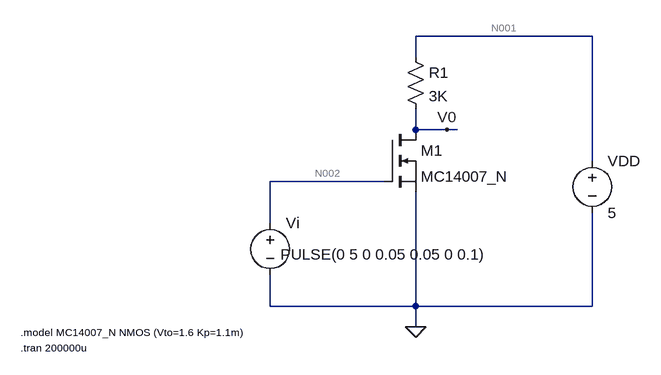
[diagram p0: schematic 1.2.3.asc]
1.2.3.asc, the LTspice schematic file:
Version 4
SHEET 1 880 680
WIRE 672 -128 400 -128
WIRE 400 -96 400 -128
WIRE 400 16 400 -16
WIRE 448 16 400 16
WIRE 464 16 448 16
WIRE 672 64 672 -128
WIRE 352 96 176 96
WIRE 176 160 176 96
WIRE 176 288 176 240
WIRE 400 288 400 112
WIRE 400 288 176 288
WIRE 672 288 672 144
WIRE 672 288 400 288
WIRE 400 320 400 288
FLAG 400 320 0
FLAG 448 16 V0
SYMBOL voltage 176 144 R0
WINDOW 3 16 64 Left 2
WINDOW 123 0 0 Left 0
WINDOW 39 0 0 Left 0
SYMATTR Value PULSE(0 5 0 0.05 0.05 0 0.1)
SYMATTR InstName Vi
SYMBOL voltage 672 48 R0
WINDOW 123 0 0 Left 0
WINDOW 39 0 0 Left 0
SYMATTR InstName VDD
SYMATTR Value 5
SYMBOL nmos 352 16 R0
SYMATTR InstName M1
SYMATTR Value MC14007_N
SYMBOL res 384 -112 R0
SYMATTR InstName R1
SYMATTR Value 3K
TEXT -208 328 Left 1 !.model MC14007_N NMOS (Vto=1.6 Kp=1.1m)
TEXT -208 352 Left 1 !.tran 200000u

The netlist it stands for:
* 1.2.3.asc
Vi N002 0 PULSE(0 5 0 0.05 0.05 0 0.1)
VDD N001 0 5
M1 V0 N002 0 0 MC14007_N
R1 N001 V0 3K
.model NMOS NMOS
.model PMOS PMOS
.lib standard.mos
.model MC14007_N NMOS (Vto=1.6 Kp=1.1m)
.tran 200000u
.backanno
.end

* Results of the author's LTspice run, read from the files saved beside the schematic
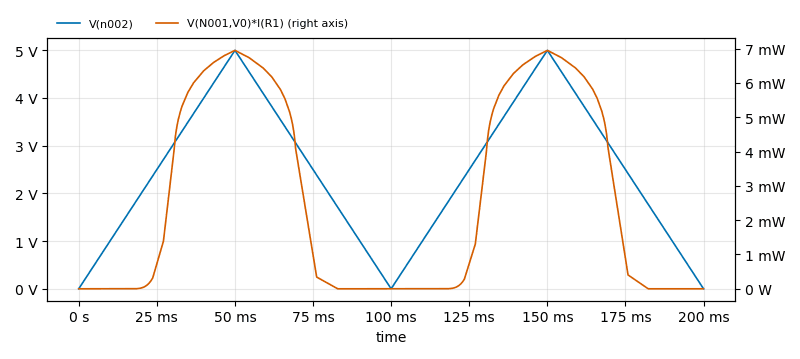
[diagram p1: Transient Analysis of 1.2.3.asc, plotted from the saved traces]
* Transient Analysis, 1 run:
*   V(n002): min 0 V, max 4.998 V, average 2.5 V, rms 2.91 V, last 0 V
*   V(N001,V0)*I(R1): min 0 W, max 6.947 mW, average 2.686 mW, rms 3.987 mW, last 0 W